# EasyEDA schematic SCH_VRegulator_2024-07-16.json
TITLE: I2C Voltage Regulator with EN; REV: 1.0; Date: 2024-06-21; Sheet: 1/1; Drawn By: Marcin Pluta; Company: pluciorx@gmail.com
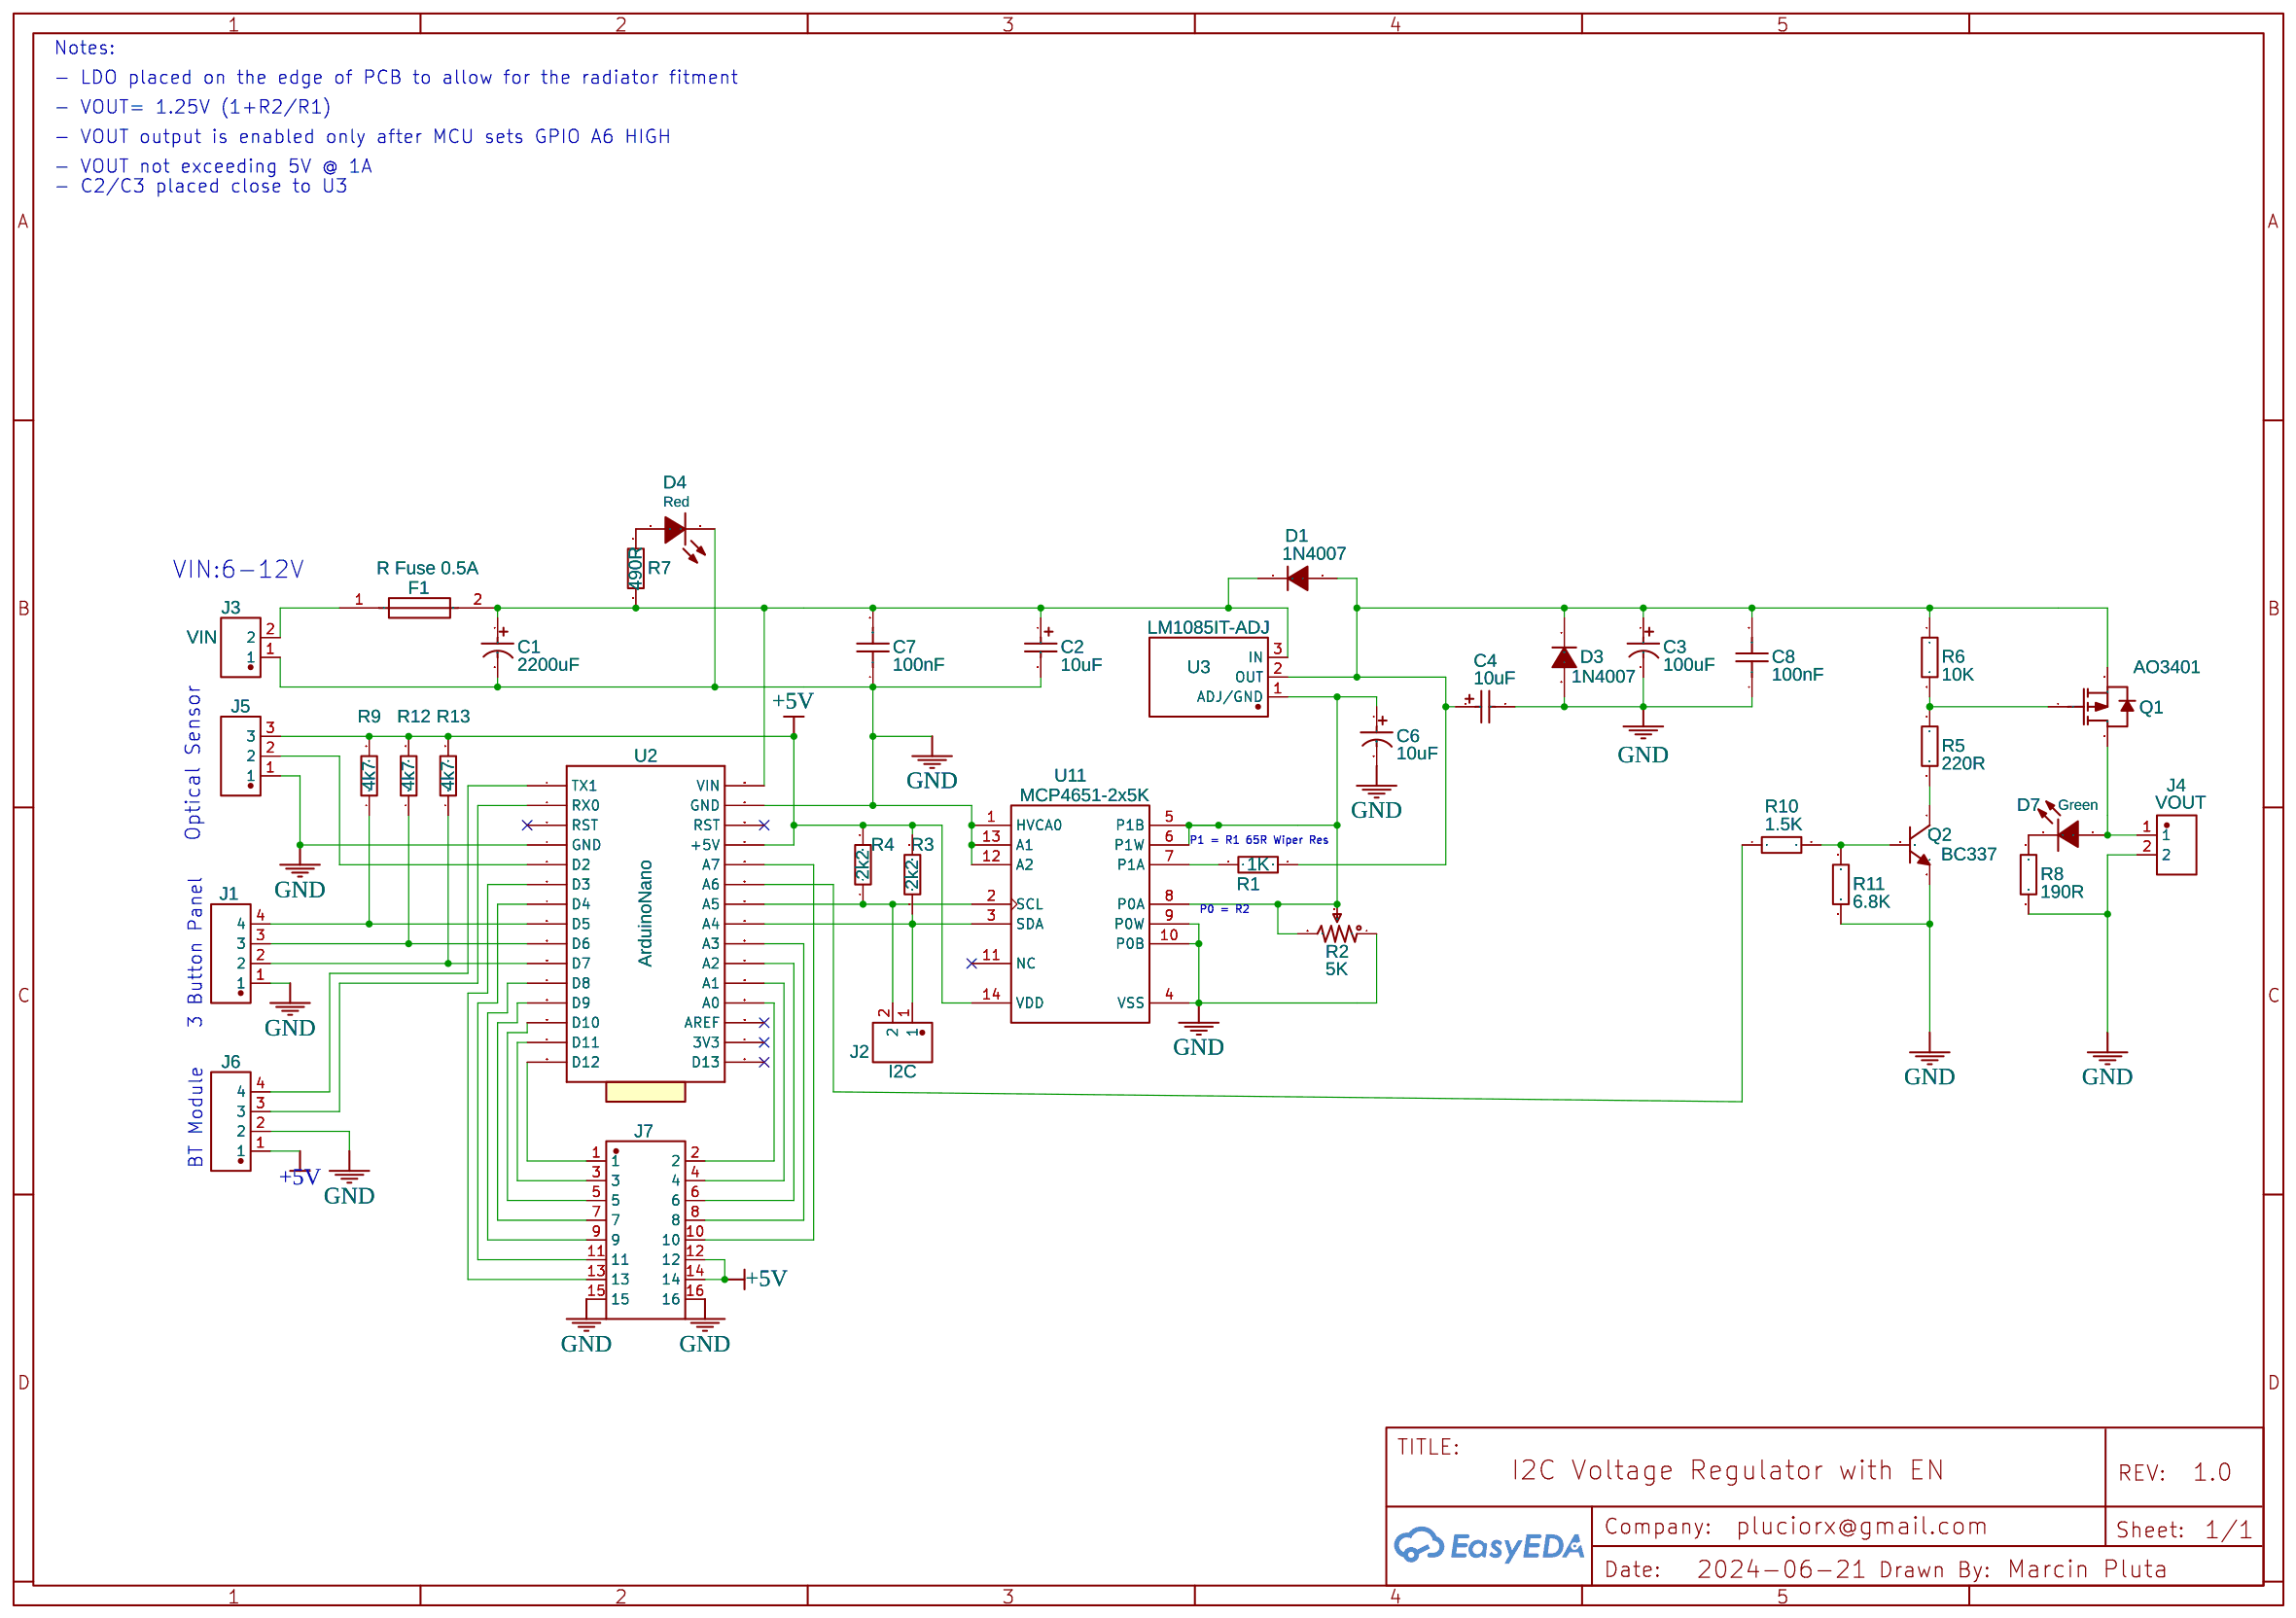
[diagram p0: schematic sheet]

## Parts
C1  2200uF  [CAP-TH_BD13.0-P5.00-D1.2-FD]
C2  10uF  [CAP-SMD_L6.0-W3.2-R-RD]
C3  100uF  [CAP-TH_BD6.3-P2.50-D1.0-FD]
C4  10uF  [CAP-SMD_L6.0-W3.2-R-RD]
C6  10uF  [CAP-TH_BD5.0-P2.00-D0.8-FD]
C7  100nF  [CAP-TH_L7.0-W3.2-P5.08-D0.6-S2.7]
C8  100nF  [CAP-TH_L7.0-W3.2-P5.08-D0.6-S2.7]
D1  1N4007  [DO-41_BD2.4-L4.7-P8.70-D0.9-RD]
D3  1N4007  [DO-41_BD2.4-L4.7-P8.70-D0.9-RD]
D4  Red  [LED-TH_BD3.0-P2.54-FD]
D7  Green  [LED-TH_BD3.0-P2.54-FD]
F1  R Fuse 0.5A  [FUSE-TH-L12.5-W2.0-P5.00-D0.8]
J1  DZ254W-11-04-65  [HDR-TH_4P-P2.54-H-M-W10.3]
J2  I2C  [CONN-TH_DB301V-3.5-2P-GN]
J3  VIN  [CONN-TH_DB301V-3.5-2P-GN]
J4  VOUT  [CONN-TH_DB301V-3.5-2P-GN]
J5  J5  [CONN-TH_DB301V-3.5-3P-GN]
J6  A2541HWV-4P_C5176037  [HDR-TH_4P-P2.54-V-F]
J7  MZ254R-22-16-10  [HDR-TH_16P-P2.54-V-M-R2-C8-S2.54-5]
Q1  AO3401  [SOT-23-3_L3.0-W1.7-P0.95-LS2.9-BR]
Q2  BC337  [TO-92-3_L5.1-W4.1-P1.27-L]
R1  1K  [R_AXIAL-0.4]
R2  5K  [RES-ADJ-TH_3P-L9.5-W4.85-P2.50-BL-BS]
R3  2k2  [R_AXIAL-0.4]
R4  2k2  [R_AXIAL-0.4]
R5  220R  [R_AXIAL-0.4]
R6  10K  [R_AXIAL-0.4]
R7  490R  [R_AXIAL-0.4]
R8  190R  [R_AXIAL-0.4]
R9  4k7  [R_AXIAL-0.4]
R10  1.5K  [R_AXIAL-0.4]
R11  6.8K  [R_AXIAL-0.4]
R12  4k7  [R_AXIAL-0.4]
R13  4k7  [R_AXIAL-0.4]
U2  ArduinoNano  [ARDUINONANO_V3]
U3  LM1085IT-ADJ  [TO-220-3_L10.0-W4.5-P2.54-L]
U11  MCP4651-2x5K  [TSSOP-14_L5.0-W4.4-P0.65-LS6.4-BL]

## Library data of the parts
C1 = 2200uF 25V 13*20: Supplier: LCSC; Manufacturer: CX(承兴); Manufacturer Part: KM228M025J20RR0VH2FP0; Supplier Part: C44598; JLCPCB Part Class: Extended Part
C2 C4 = TAJC106K025RNJ: Supplier: LCSC; Manufacturer: Kyocera AVX; Supplier Part: C7210; JLCPCB Part Class: Extended Part
C3 = ERS1EM101E11OT: Supplier: LCSC; Manufacturer: AISHI(艾华集团); Supplier Part: C112509; JLCPCB Part Class: Extended Part
C6 = KF100M025C110A: Supplier: LCSC; Manufacturer: CapXon(丰宾); Supplier Part: C62930; JLCPCB Part Class: Extended Part
C7 C8 = CC2A104ZC1ED3F7C1100: Supplier: LCSC; Supplier Part: C2761731; Manufacturer: Dersonic(德尔创); JLCPCB Part Class: Extended Part; Contributor: lcsc
D1 D3 = 1N4007_C84179: Supplier: LCSC; Manufacturer: DYELEC; Supplier Part: C84179
D4 D7 = WP710A10ID: Contributor: lcsc; Supplier: LCSC; Supplier Part: C5831626; Manufacturer: Kingbright; JLCPCB Part Class: Extended Part
F1 = RESETTABLEFUSE-500MA: Contributor: LCSC; Supplier: LCSC; Supplier Part: C9900007669; Manufacturer: null; Manufacturer Part: ResettableFuse-500mA
J1 = DZ254W-11-04-65: Contributor: LCSC; Supplier: LCSC; Supplier Part: C2935929; Manufacturer: DEALON(德艺隆); JLCPCB Part Class: Extended Part
J2-J4 = DB301V-3.5-2P-GN: Contributor: LCSC; Supplier: LCSC; Supplier Part: C695629; Manufacturer: DORABO(地博电气); Manufacturer Part: DB301V-3.5-2P-GN-S; JLCPCB Part Class: Extended Part
J5 = DB301V-3.5-3P-GN: Contributor: LCSC; Supplier: LCSC; Supplier Part: C695630; Manufacturer: DORABO(地博电气); Manufacturer Part: DB301V-3.5-3P-GN-S; JLCPCB Part Class: Extended Part
J6 = A2541HWV-4P_C5176037: Contributor: lcsc; Supplier: LCSC; Supplier Part: C5176037; Manufacturer: CJT(长江连接器); Manufacturer Part: A2541HWV-4P; JLCPCB Part Class: Extended Part; Package Display: No
J7 = MZ254R-22-16-10: Supplier: LCSC; Supplier Part: C19191975; Manufacturer: DEALON(德艺隆); Contributor: lcsc; Package Display: No
Q1 = AO3401_C2977510: Contributor: LCSC; Supplier: LCSC; Supplier Part: C2977510; Manufacturer: YFW(佑风微); JLCPCB Part Class: Extended Part; link: https://lcsc.com/eda_search?q=C2977510&%26type=1&ref=editor
Q2 = BC33740BU: Contributor: LCSC; Supplier: LCSC; Supplier Part: C896667; Manufacturer: onsemi(安森美); JLCPCB Part Class: Extended Part; Package Display: No
R1 R3-R13 = RESISTOR 100 OHM 1W COPY: Supplier: Farnell; Supplier Part: 1357879; Manufacturer: Multicomp; Manufacturer Part: MOR01SJ0101A10; Contributor: balix
R2 = 3296W-1-502: Contributor: LCSC; Supplier: LCSC; Supplier Part: C118907; Manufacturer: BOCHEN(博晨); JLCPCB Part Class: Extended Part
U2 = ArduinoNano_FIX: Contributor: jyoshikuta
U3 = LM1085IT-ADJG: Contributor: lcsc; Supplier: LCSC; Supplier Part: C5145332; Manufacturer: HGC(深圳汉芯)
U11 = MCP4651-103E/ST: Contributor: LCSC; Supplier: LCSC; Manufacturer: MICROCHIP(美国微芯); Supplier Part: C144237; JLCPCB Part Class: Extended Part

## Nets
+5V: J5.3 J6.1 J7.12 J7.14 R3.2 R4.2 R9.2 R12.2 R13.2 U2.27(+5V) U11.14(VDD)
GND: C1.2 C2.2 C3.2 C4.2 C6.2 C7.1 C8.1 D3.2(A) D4.2(K) J1.1 J3.1 J4.2 J5.1 J6.2 J7.15 J7.16 Q2.3(E) R2.1 R8.2 R11.1 U2.4(GND) U2.29(GND) U11.1(HVCA0) U11.4(VSS) U11.9(P0W) U11.10(P0B) U11.12(A2) U11.13(A1)
Net-(C1-1): C1.1 C2.1 C7.2 D1.1(C) F1.2 R7.2 U2.30(VIN) U3.3(IN)
Net-(C3-1): C3.1 C4.1 C8.2 D1.2(A) D3.1(C) Q1.2(S) R1.1 R6.1 U3.2(OUT)
Net-(C6-1): C6.1 R2.2 R2.3 U3.1(ADJ/GND) U11.5(P1B) U11.6(P1W) U11.8(P0A)
Net-(D4-1): D4.1(A) R7.1
Net-(D7-1): D7.1(A) J4.1 Q1.3(D)
Net-(D7-2): D7.2(K) R8.1
Net-(F1-1): F1.1 J3.2
Net-(J1-2): J1.2 R13.1 U2.10(D7)
Net-(J1-3): J1.3 R12.1 U2.9(D6)
Net-(J1-4): J1.4 R9.1 U2.8(D5)
Net-(J2-1): J2.1 R3.1 U2.23(A4) U11.3(SDA)
Net-(J2-2): J2.2 R4.1 U2.24(A5) U11.2(SCL)
Net-(J5-2): J5.2 U2.5(D2)
Net-(J6-3): J6.3 U2.2(RX0)
Net-(J6-4): J6.4 U2.1(TX1)
Net-(J7-1): J7.1 U2.15(D12)
Net-(J7-2): J7.2 U2.19(A0)
Net-(J7-3): J7.3 U2.14(D11)
Net-(J7-4): J7.4 U2.20(A1)
Net-(J7-5): J7.5 U2.13(D10)
Net-(J7-6): J7.6 U2.21(A2)
Net-(J7-7): J7.7 U2.12(D9)
Net-(J7-8): J7.8 U2.22(A3)
Net-(J7-9): J7.9 U2.11(D8)
Net-(J7-10): J7.10 U2.26(A7)
Net-(J7-11): J7.11 U2.7(D4)
Net-(J7-13): J7.13 U2.6(D3)
Net-(Q1-1): Q1.1(G) R5.1 R6.2
Net-(Q2-1): Q2.1(C) R5.2
Net-(Q2-2): Q2.2(B) R10.2 R11.2
Net-(R1-2): R1.2 U11.7(P1A)
Net-(R10-1): R10.1 U2.25(A6)

Not connected (* = marked no-connect by the designer): U2 3(RST)* 16(D13)* 17(3V3)* 18(AREF)* 28(RST)*; U11 11(NC)*

## Notes on the sheet
- Notes:
- - LDO placed on the edge of PCB to allow for the radiator fitment
- - VOUT= 1.25V (1+R2/R1)
- - VOUT output is enabled only after MCU sets GPIO A6 HIGH
- - VOUT not exceeding 5V @ 1A
- - C2/C3 placed close to U3
- VIN:6-12V
- P1 = R1 65R Wiper Res
- Optical Sensor
- P0 = R2
- 3 Button Panel
- BT Module
